# EasyEDA Pro project ProPrj_103-HQU15集成板_Vel2.0.epro, board PCB1
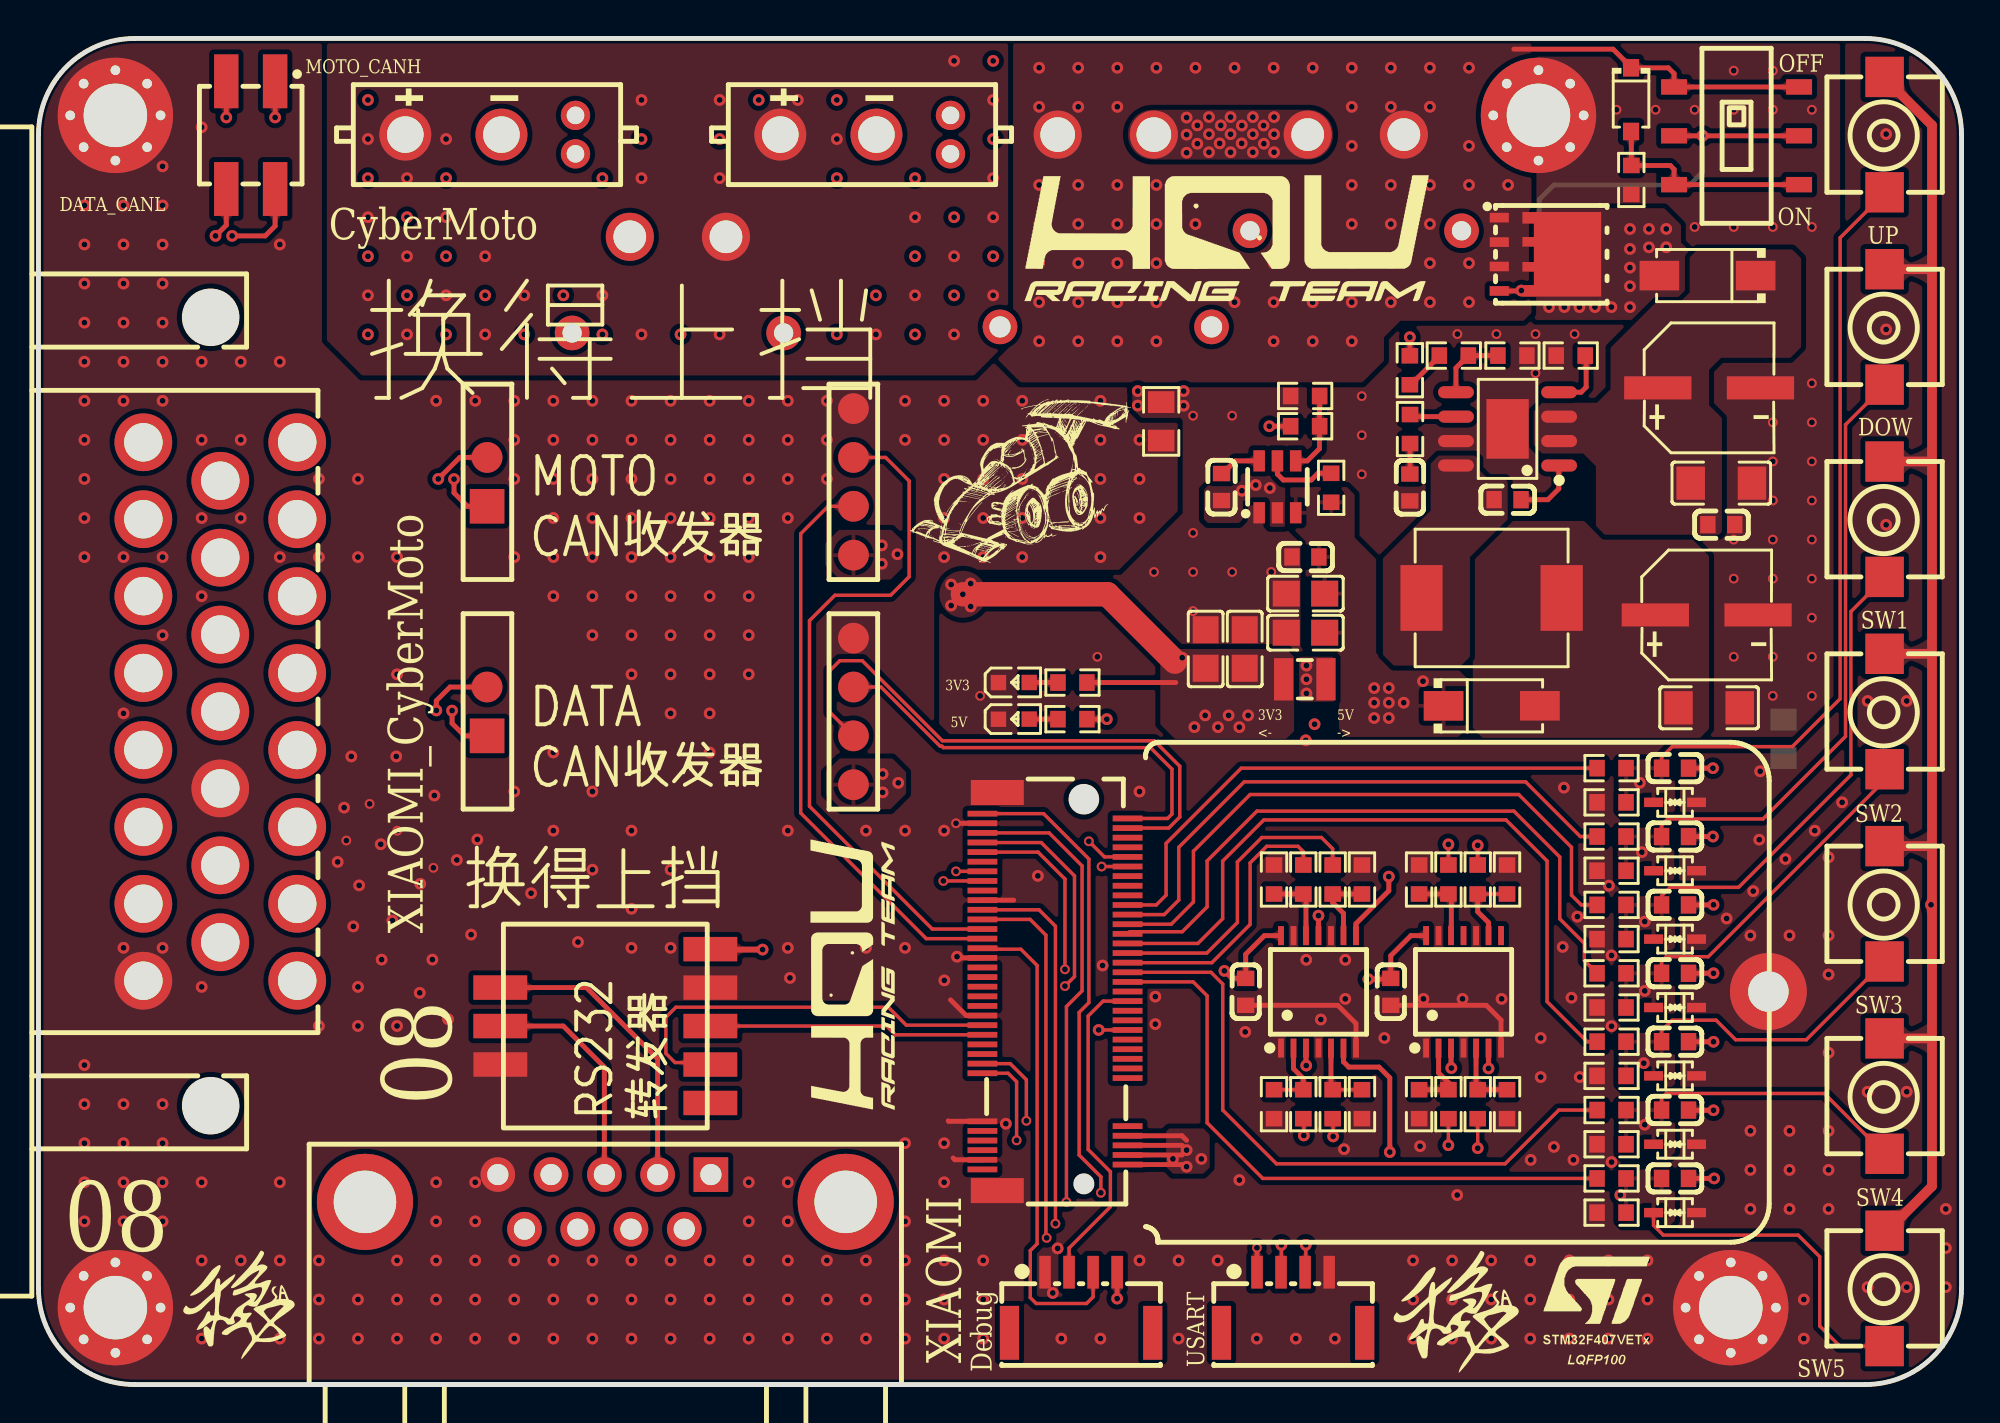
[diagram p6: board, top side]
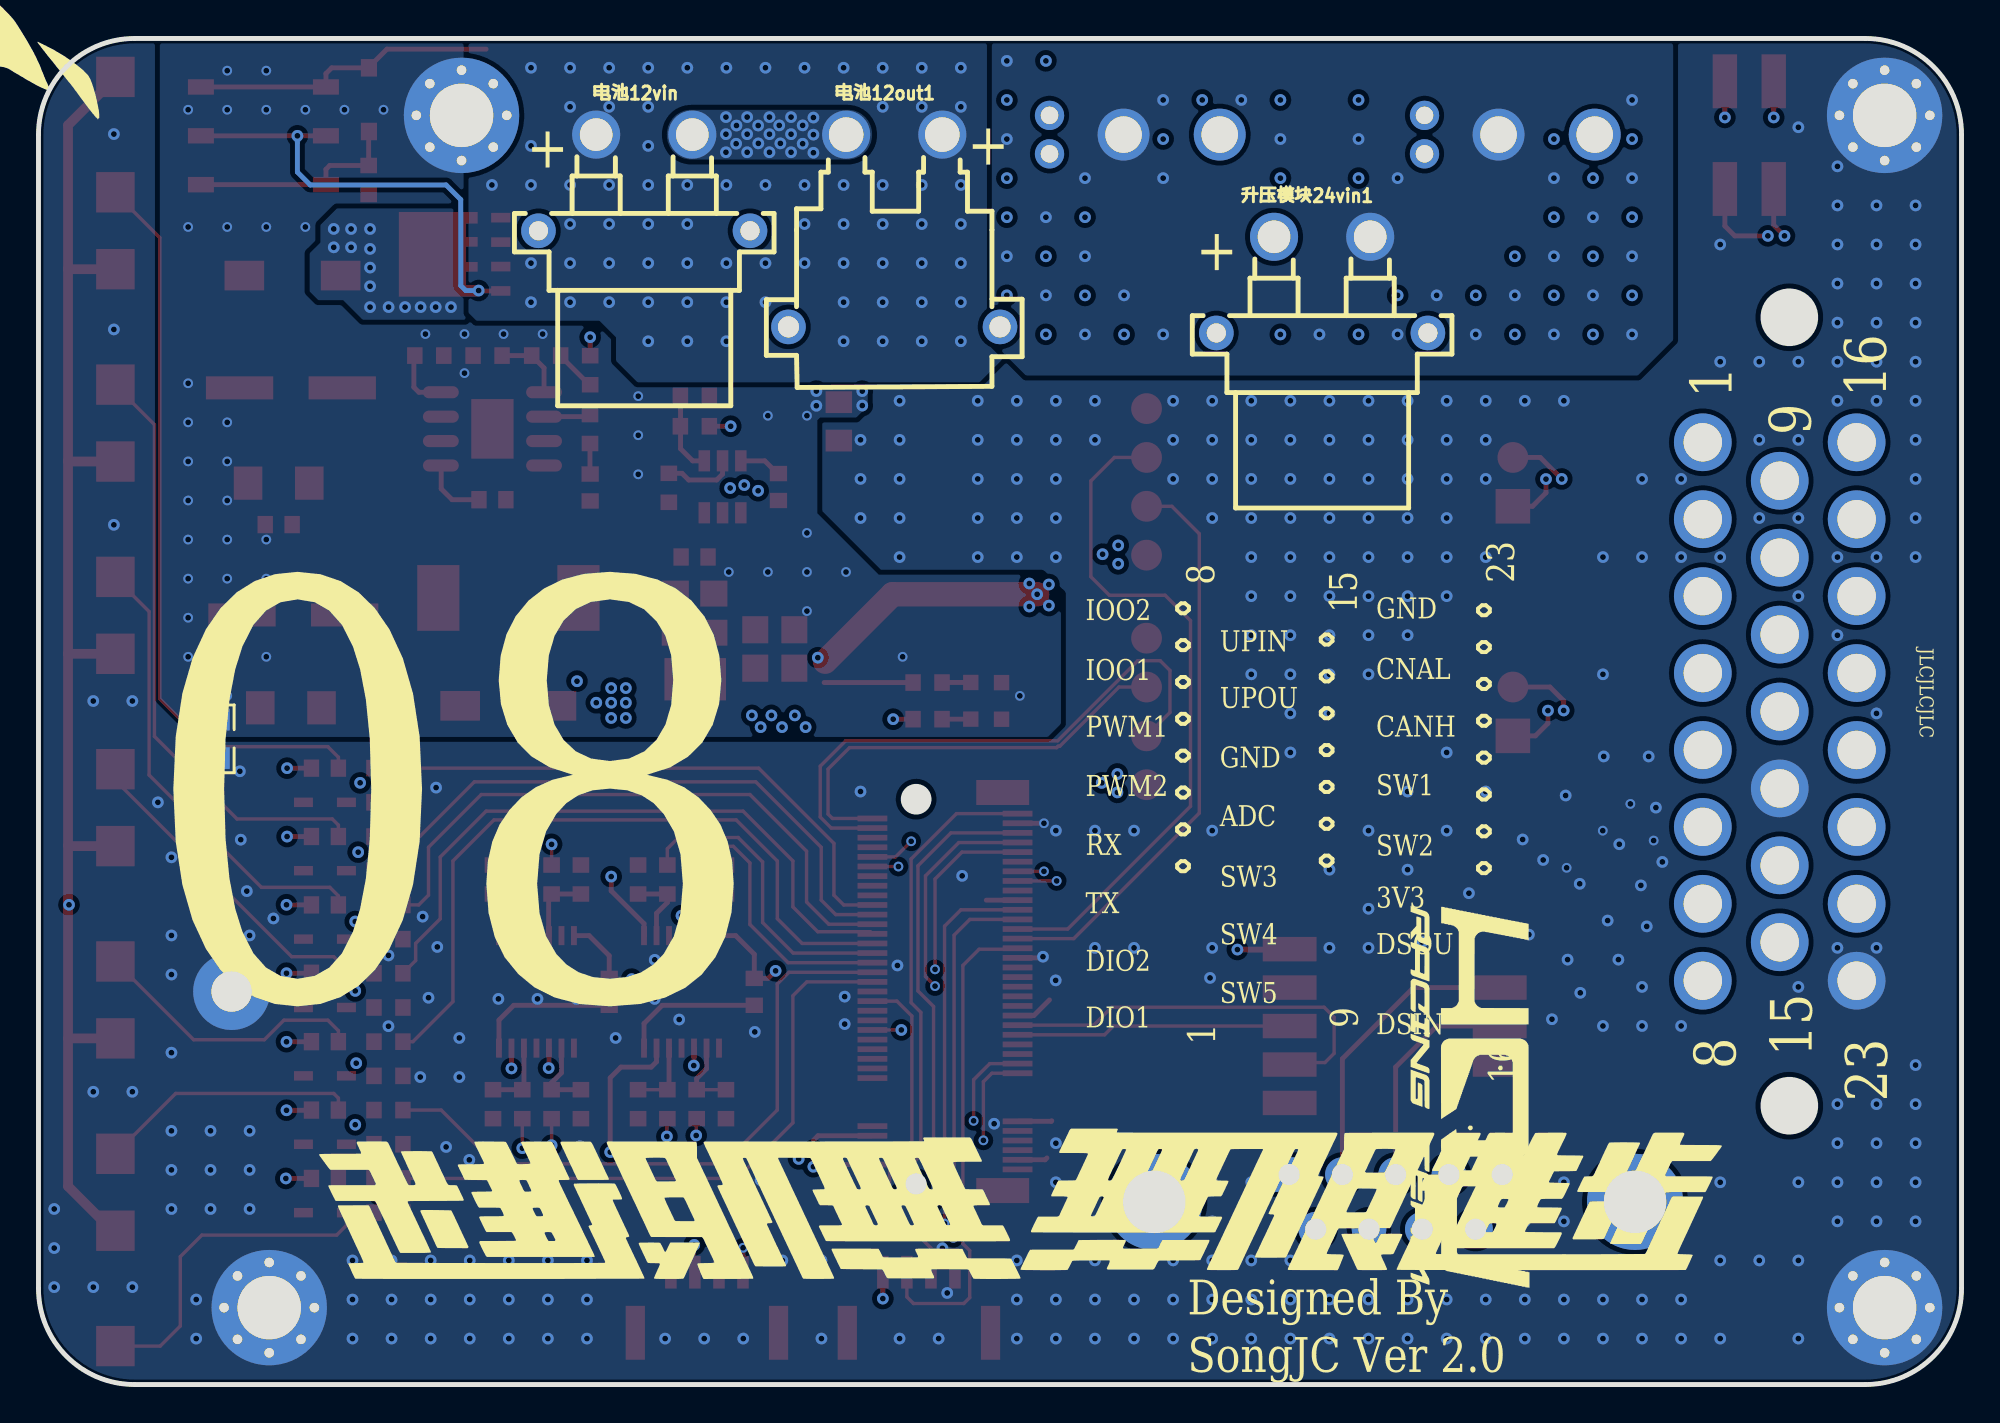
[diagram p7: board, bottom side, seen from below]

Outline 100 x 70 mm; copper layers: Top Layer, Inner1, Inner2, Bottom Layer. Coordinates in mm from the lower left corner of the outline.
Outline path: 0,65 0,5 arc(1.46,1.46) 5,0 95,0 arc(98.54,1.46) 100,5 100,65 arc(98.54,68.54) 95,70 5,70 arc(1.46,68.54) 0,65
Stack: Top Layer 0.035mm 外层铜厚1oz / Dielectric1 0.2104mm 7628 RC49% 8.6mil / Inner1 0.0152mm 内层铜厚 / Dielectric2 1.065mm 1.1mm H/HOZ Copper / Inner2 0.0152mm 内层铜厚 / Dielectric3 0.2104mm 7628 RC49% 8.6mil / Bottom Layer 0.035mm 外层铜厚1oz

## Design rules (mm)
net DATA_CANH: DP2
net DATA_CANL: DP2
net MOTO_CANL: DP1
net MOTO_CANH: DP1
template: 自定义配置
spacing copperThickness1oz (default): track to track 0.102, other pairs 0.152 to 0.3
spacing copperThickness2oz: track to track 0.203, other pairs 0.152 to 0.3
track width copperThickness1oz (default): min 0.127, default 0.254, max 2.54
track width copperThickness2oz: min 0.203, default 0.254, max 2.54
differential pair differentialPair (default): width min 0.127, default 0.254, max 2.54; gap min 0.152, default 0.152
via viaSize (default): diameter min 0.5, default 0.61, max 10; hole min 0.3, default 0.305, max 6.299
net $2N1574 uses ZHILIAN
net $2N643 uses ZHILIAN
net $2N637 uses ZHILIAN
net $2N640 uses ZHILIAN
net GND_PRO uses ZHILIAN
net GND_BAT uses ZHILIAN
net VCC_+3V3 uses ZHILIAN
net VCC_BAT uses ZHILIAN
net VCC_+12V uses ZHILIAN
net VCC_+24V uses ZHILIAN

## Placement (name value [footprint] x y rotation side)
C78  100uF  [CAP-SMD_BD6.3-L6.6-W6.6-LS7.4-FD]  86.87 51.83 0 top
C79  100nF  [C0603]  87.51 44.72 180 top
C80  4.7uF  [c1206]  87.51 46.88 180 top
C81  100nF  [C0603]  76.39 46.02 180 top
C82  47uF  [c1206]  86.87 35.19 180 top
C83  4.7nF  [C0603]  71.31 46.65 270 top
C84  100uF  [CAP-SMD_BD6.3-L6.6-W6.6-LS7.4-FD]  86.75 40.02 0 top
C87  100nF  [C0603]  61.52 46.67 90 top
C88  22uF  [C0805]  60.69 38.25 270 top
C89  22uF  [C0805]  62.73 38.25 270 top
C90  10uF  [C0805]  65.88 39.1 180 top
C91  10uF  [C0805]  65.88 41.13 180 top
C92  100nF  [C0603]  65.88 43.03 180 top
C158  100nF  [C0603]  85.1 28.5 0 top
C160  100nF  [C0603]  85.1 32.05 0 top
C161  100nF  [C0603]  85.1 24.94 0 top
C162  100nF  [C0603]  85.1 21.39 0 top
C163  100nF  [C0603]  85.1 17.83 0 top
C164  100nF  [C0603]  85.1 14.27 0 top
C165  100nF  [C0603]  85.1 10.72 0 top
C166  100nF  [C0603]  70.32 20.42 270 top
C167  100nF  [C0603]  62.78 20.42 270 top
CN2  APCI0078-P002A  [NGFF-SMD-BKEY 5+6(2235))]  53 20.4 90 top
CN5  776087-1  [CONN-TH_776087-1]  9.45 35 270 top
CN16  XT30(2+2)PB-M.G.B  [CONN-TH_XT30PB-M]  43 65 0 top
CN17  XT30(2+2)PB-M.G.B  [CONN-TH_XT30PB-M]  23.5 65 0 top
D2  BZT52C16  [SOD-123_L2.7-W1.7-LS3.8-RD]  82.81 66.82 270 top
D24  SS54  [SMA_L4.4-W2.8-LS5.4-R-RD]  86.79 57.67 180 top
D25  SS54  [SMA_L4.4-W2.8-LS5.4-R-RD]  75.57 35.3 0 top
D32  PESD3V3L1BA-N  [SOD-323_L1.8-W1.3-LS2.5-BI]  85.1 30.28 180 top
D33  PESD3V3L1BA-N  [SOD-323_L1.8-W1.3-LS2.5-BI]  85.1 26.72 180 top
D34  PESD3V3L1BA-N  [SOD-323_L1.8-W1.3-LS2.5-BI]  85.1 23.16 180 top
D35  PESD3V3L1BA-N  [SOD-323_L1.8-W1.3-LS2.5-BI]  85.1 19.61 180 top
D36  PESD3V3L1BA-N  [SOD-323_L1.8-W1.3-LS2.5-BI]  85.1 16.05 180 top
D37  PESD3V3L1BA-N  [SOD-323_L1.8-W1.3-LS2.5-BI]  85.1 12.5 180 top
D38  PESD3V3L1BA-N  [SOD-323_L1.8-W1.3-LS2.5-BI]  85.1 8.94 180 top
H1  X6521WVS-2x02H-C60D74  [hdr-smd_4p-p2.54-v-m-r2-c5-s7.4]  11.04 64.97 180 top
H2  X6521WVS-2x04H-C60D74  [HDR-SMD_8P-P2.54-V-M-R2-C5-S7.4]  29.48 18.64 180 top
H4  PM254V-11-06-H85  [HDR-TH_6P-P2.54-V-F]  42.38 35 90 top
H5  PM254V-11-06-H85  [HDR-TH_6P-P2.54-V-F]  42.38 46.94 90 top
J1  -  [M3螺帽]  88 4 0 top
J2  -  [M3螺帽]  78 66 0 top
J3  -  [M3螺帽]  4 4 0 top
J4  -  [M3螺帽]  4 66 0 top
L4  4.7uH  [IND-SMD_L7.8-W7.0_MAPM0630F]  75.56 40.91 180 top
L5  2.2uH  [IND-SMD_L2.5-W2.0_MHCHL2520]  65.85 36.68 0 top
LED6  NCD0603R1  [LED0603-RD_RED]  50.72 34.6 0 top
LED7  NCD0603R1  [LED0603-RD_RED]  50.72 36.51 0 top
LINK1  WAFER-GH1.25-4PWB  [CONN-SMD_4P-P1.25_XUNPU_WAFER-GH1.25-4PWB]  54.22 4.27 0 top
Q11  TPH1R403NL  [POWERVDFN-8_L6.2-W5.2-P1.27-LS6.0-BL]  77.74 58.77 270 top
R126  200K  [R0603]  79.68 53.51 0 top
R127  51K  [R0603]  71.31 52.75 90 top
R128  1.5K  [R0603]  73.6 53.51 180 top
R129  10K  [R0603]  76.65 53.51 180 top
R130  4.7K  [R0603]  53.77 34.6 0 top
R131  20K  [R0603]  71.32 49.69 270 top
R132  10K  [R0603]  82.83 62.64 90 top
R135  4.7K  [R0603]  53.77 36.51 0 top
R136  10kΩ  [R0603]  67.22 46.63 90 top
R137  10kΩ  [R0603]  65.87 51.41 0 top
R138  33.2kΩ  [R0603]  65.87 49.83 0 top
R194  1kΩ  [R0603]  81.8 32.05 0 top
R195  4.7kΩ  [R0603]  81.8 30.28 0 top
R196  0Ω  [R0805]  58.38 50.09 270 top
R198  4.7kΩ  [R0603]  81.8 26.72 0 top
R199  1kΩ  [R0603]  81.8 24.94 0 top
R200  4.7kΩ  [R0603]  81.8 23.16 0 top
R211  1kΩ  [R0603]  81.8 21.39 0 top
R212  4.7kΩ  [R0603]  81.8 19.61 0 top
R213  0Ω  [R0805]  90.74 33.58 270 bottom
R216  1kΩ  [R0603]  81.8 17.83 0 top
R217  4.7kΩ  [R0603]  81.8 16.05 0 top
R218  1kΩ  [R0603]  81.8 14.27 0 top
R219  4.7kΩ  [R0603]  81.8 12.5 0 top
R220  1kΩ  [R0603]  81.8 10.72 0 top
R221  4.7kΩ  [R0603]  81.8 8.94 0 top
R222  10kΩ  [R0603]  76.37 14.58 90 top
R223  10kΩ  [R0603]  71.79 14.58 90 top
R224  10kΩ  [R0603]  76.37 26.26 270 top
R225  10kΩ  [R0603]  71.79 26.26 270 top
R226  100R  [R0603]  73.32 26.26 90 top
R227  100R  [R0603]  74.84 26.26 90 top
R228  100R  [R0603]  73.32 14.58 270 top
R229  100R  [R0603]  74.84 14.58 270 top
R230  10kΩ  [R0603]  68.82 14.58 90 top
R231  10kΩ  [R0603]  64.25 14.58 90 top
R232  10kΩ  [R0603]  68.82 26.26 270 top
R233  10kΩ  [R0603]  64.25 26.26 270 top
R234  100R  [R0603]  65.77 26.26 90 top
R235  100R  [R0603]  67.3 26.26 90 top
R236  100R  [R0603]  65.77 14.58 270 top
R237  100R  [R0603]  67.3 14.58 270 top
R238  1kΩ  [R0603]  81.8 28.5 0 top
SW1  SS-3235S-L3  [SW-SMD_SS-3235S-L3.00]  88.3 64.94 90 top
SW9  K2-1817UQ-C4SW-01  [KEY-SMD_2P-L6.0-W6.0-P6.00]  96 55 90 top
SW11  K2-1817UQ-C4SW-01  [KEY-SMD_2P-L6.0-W6.0-P6.00]  96 65 90 top
SW12  K2-1817UQ-C4SW-01  [KEY-SMD_2P-L6.0-W6.0-P6.00]  96 45 90 top
SW13  K2-1817UQ-C4SW-01  [KEY-SMD_2P-L6.0-W6.0-P6.00]  96 35 90 top
SW14  K2-1817UQ-C4SW-01  [KEY-SMD_2P-L6.0-W6.0-P6.00]  96 25 90 top
SW15  K2-1817UQ-C4SW-01  [KEY-SMD_2P-L6.0-W6.0-P6.00]  96 15 90 top
SW16  K2-1817UQ-C4SW-01  [KEY-SMD_2P-L6.0-W6.0-P6.00]  96 5 90 top
U27  SP1N28STER  [ESOP-8_L4.9-W3.9-P1.27-LS6.0-BL-EP3.1]  76.39 49.7 90 top
U32  TPS563201DDCR  [SOT-23-6_L2.9-W1.6-P0.95-LS2.8-BR]  64.43 46.68 270 top
U54  DR-9F  [DR9-TH_ZHOUR_DR-9P-L]  29.48 9.5 0 top
U55  SN74HC125PWR  [TSSOP-14_L5.0-W4.4-P0.65-LS6.5-BL]  74.1 20.42 0 top
U56  SN74HC125PWR  [TSSOP-14_L5.0-W4.4-P0.65-LS6.5-BL]  66.56 20.42 0 top
USART1  WAFER-GH1.25-4PWB  [CONN-SMD_4P-P1.25_XUNPU_WAFER-GH1.25-4PWB]  65.24 4.27 0 top
升压模块24vin1  XT30PW-F20.G.Y  [CONN-TH_XT30PW-F-1]  33.25 57.19 180 bottom
电池12out1  XT30PW-M30.G.Y  [CONN-TH_XT30PW-M]  55.5 60 180 bottom
电池12vin  XT30PW-F20.G.Y  [CONN-TH_XT30PW-F-1]  68.5 62.5 180 bottom

## Footprints (pads in the part's own frame, mm; a bottom-side part is the same pattern mirrored in y, then rotated)
C0603
  rect 0.8x0.9 smd: 1(-0.7,0) 2(0.7,0)
C0805
  rect 1.41x1.35 smd: 1(-1,0) 2(1,0)
c1206
  rect 1.485x1.728 smd: 1(-1.593,0) 2(1.593,0)
CAP-SMD_BD6.3-L6.6-W6.6-LS7.4-FD
  rect 3.5x1.2 smd: 1(-2.67,0) 2(2.67,0)
CONN-SMD_4P-P1.25_XUNPU_WAFER-GH1.25-4PWB
  rect 0.6x1.7 smd: 1(-1.875,1.575) 2(-0.625,1.575) 3(0.625,1.575) 4(1.875,1.575)
  rect 1x2.8 smd: 5(3.725,-1.575) 6(-3.725,-1.575)
CONN-TH_776087-1
  round 3 hole 2: 1(-14,4) 2(-10,4) 3(-6,4) 4(-2,4) 5(2,4) 6(6,4) 7(10,4) 8(14,4) 9(-12,0) 10(-8,0) 11(-4,0) 12(0,0) 13(4,0) 14(8,0) 15(12,0) 16(-14,-4) 17(-10,-4) 18(-6,-4) 19(-2,-4) 20(2,-4) 21(6,-4) 22(10,-4) 23(14,-4)
CONN-TH_XT30PB-M
  round 1.524 hole 0.914: 1(4.425,1) 2(4.425,-1)
  round 2.7 hole 1.9: 3(0.575,0) 4(-4.425,0)
CONN-TH_XT30PW-F-1
  round 2.5 hole 1.7: 1(-2.5,2.5) 2(2.5,2.5)
  round 1.8 hole 1: 3(5.5,-2.5) 4(-5.5,-2.5)
CONN-TH_XT30PW-M
  round 2.5 hole 1.8: 1(-2.5,5) 2(2.5,5)
  round 1.8 hole 1.1: 3(5.5,-5) 4(-5.5,-5)
DR9-TH_ZHOUR_DR-9P-L
  rect 1.8x1.8 hole 1.1: 1(5.489,1.42)
  round 1.8 hole 1.1: 2(2.719,1.42) 3(-0.051,1.42) 4(-2.821,1.42) 5(-5.59,1.42) 6(4.104,-1.42) 7(1.335,-1.42) 8(-1.435,-1.42) 9(-4.205,-1.42)
  round 5 hole 3.25: 10(-12.5,0) 11(12.5,0)
ESOP-8_L4.9-W3.9-P1.27-LS6.0-BL-EP3.1
  oval 0.63x1.865 smd: 1(-1.905,-2.683) 2(-0.635,-2.683) 3(0.635,-2.683) 4(1.905,-2.683) 5(1.905,2.683) 6(0.635,2.683) 7(-0.635,2.683) 8(-1.905,2.683)
  rect 3.1x2.2 smd: 9(0,0)
hdr-smd_4p-p2.54-v-m-r2-c5-s7.4
  rect 1.27x2.8 smd: 1(-1.27,-2.8) 2(-1.27,2.8) 3(1.27,-2.8) 4(1.27,2.8)
HDR-SMD_8P-P2.54-V-M-R2-C5-S7.4
  rect 2.8x1.27 smd: 1(5.461,-2) 2(5.461,0) 3(5.461,2) 4(-5.461,4) 5(-5.461,2) 6(-5.461,0) 7(-5.461,-2) 8(-5.461,-4)
HDR-TH_6P-P2.54-V-F
  rect 1.8x1.8 smd: 1(-1.267,19.05)
  round 1.6 smd: 2(1.273,19.05) 3(-3.807,0) 4(-1.267,0) 5(1.273,0) 6(3.813,0)
IND-SMD_L2.5-W2.0_MHCHL2520
  rect 1x2.2 smd: 1(-1.1,0) 2(1.1,0)
IND-SMD_L7.8-W7.0_MAPM0630F
  rect 2.194x3.42 smd: 1(3.643,0) 2(-3.643,0)
KEY-SMD_2P-L6.0-W6.0-P6.00
  rect 2.1x2 smd: 1(-3,0) 2(3,0)
LED0603-RD_RED
  rect 0.8x0.8 smd: 1(-0.799,-0.004) 2(0.799,0.004)
M3螺帽
  round 6 hole 3.302: 1(0,0)
  round 1 hole 0.5: 2(0,2.349) 3(0,-2.349) 4(2.349,0) 5(-2.349,0) 6(1.651,1.651) 7(-1.651,-1.651) 8(1.651,-1.651) 9(-1.651,1.651)
NGFF-SMD-BKEY 5+6(2235))
  rect 0.3x1.55 smd: 1(-9.212,3.914) 2(-8.962,-3.635) 3(-8.712,3.914) 4(-8.462,-3.635) 5(-8.212,3.914) 6(-7.962,-3.635) 7(-7.712,3.914) 8(-7.462,-3.635) 9(-7.212,3.914) 10(-6.962,-3.635) 11(-6.712,3.914) 20(-4.462,-3.635) 21(-4.212,3.914) 22(-3.962,-3.635) 23(-3.712,3.914) 24(-3.462,-3.635) 25(-3.212,3.914) 26(-2.962,-3.635) 27(-2.712,3.914) 28(-2.462,-3.635) 29(-2.212,3.914) 30(-1.962,-3.635) 31(-1.712,3.914) 32(-1.462,-3.635) 33(-1.212,3.914) 34(-0.962,-3.635) 35(-0.712,3.914) 36(-0.462,-3.635) 37(-0.212,3.914) 38(0.038,-3.635) 39(0.288,3.914) 40(0.538,-3.635) 41(0.788,3.914) 42(1.038,-3.635) 43(1.288,3.914) 44(1.538,-3.635) 45(1.788,3.914) 46(2.038,-3.635) 47(2.288,3.914) 48(2.538,-3.635) 49(2.788,3.914) 50(3.038,-3.635) 51(3.288,3.914) 52(3.538,-3.635) 53(3.788,3.914) 54(4.038,-3.635) 55(4.288,3.914) 56(4.538,-3.635) 57(4.788,3.914) 58(5.038,-3.635) 59(5.288,3.914) 60(5.538,-3.635) 61(5.788,3.914) 62(6.038,-3.635) 63(6.288,3.914) 64(6.538,-3.635) 65(6.788,3.914) 66(7.038,-3.635) 67(7.288,3.914) 68(7.538,-3.635) 69(7.788,3.914) 70(8.038,-3.635) 71(8.288,3.914) 72(8.538,-3.635) 73(8.788,3.914) 74(9.038,-3.635) 75(9.288,3.914)
  round 4 hole 2.1: 12(0.038,-36.957)
  rect 1.3x2.75 smd: 76(-10.312,3.139) 77(10.388,3.139)
POWERVDFN-8_L6.2-W5.2-P1.27-LS6.0-BL
  rect 0.5x1 smd: 1(-1.905,-1.775) 2(-0.635,-1.775) 3(0.635,-1.775) 4(1.905,-1.775)
  custom 4.4x4.1 smd: 5(0,1.775)
R0603
  rect 0.806x0.864 smd: 1(-0.753,0) 2(0.753,0)
R0805
  rect 1.133x1.377 smd: 1(-1,0) 2(1,0)
SMA_L4.4-W2.8-LS5.4-R-RD
  rect 2.062x1.539 smd: 1(2.503,0) 2(-2.503,0)
SOD-123_L2.7-W1.7-LS3.8-RD
  rect 0.91x0.84 smd: 1(-1.655,0) 2(1.655,0)
SOD-323_L1.8-W1.3-LS2.5-BI
  rect 0.985x0.49 smd: 1(-1.117,0) 2(1.117,0)
SOT-23-6_L2.9-W1.6-P0.95-LS2.8-BR
  rect 1.1x0.6 smd: 1(1.35,-0.95) 2(1.35,0) 3(1.35,0.95) 4(-1.35,0.95) 5(-1.35,0) 6(-1.35,-0.95)
SW-SMD_SS-3235S-L3.00
  rect 0.8x1.35 smd: 1(-2.54,3.25) 2(0,3.25) 3(2.54,3.25) 4(-2.54,-3.25) 5(0,-3.25) 6(2.54,-3.25)
TSSOP-14_L5.0-W4.4-P0.65-LS6.5-BL
  rect 0.305x0.991 smd: 1(-1.95,-2.925) 2(-1.3,-2.925) 3(-0.65,-2.925) 4(0,-2.925) 5(0.65,-2.925) 6(1.3,-2.925) 7(1.95,-2.925) 8(1.95,2.925) 9(1.3,2.925) 10(0.65,2.925) 11(0,2.925) 12(-0.65,2.925) 13(-1.3,2.925) 14(-1.95,2.925)

## Nets
As in the schematic, except:
GND_BAT: C78.2 C79.1 C80.1 C82.1 C83.2 C84.2 C88.1 C89.1 C90.2 C91.2 C92.2 CN16.3 CN17.3 J2.1 J2.2 J2.3 J2.4 J2.5 J2.6 J2.7 J2.8 J2.9 LED6.1 LED7.1 R126.1 R129.1 R132.1 R137.1 R196.1 R213.1 U27.7 U27.9 U32.1 升压模块24vin1.2 电池12out1.1 电池12vin.2
GND_PRO: C166.2 C167.2 CN2.3 CN2.11 CN2.12 CN2.33 CN2.45 CN2.57 CN2.73 CN2.76 CN2.77 CN5.13 CN5.23 D32.1 D33.1 D34.1 D35.1 D36.1 D37.1 D38.1 H2.3 H2.7 H4.6 H5.6 J1.1 J1.2 J1.3 J1.4 J1.5 J1.6 J1.7 J1.8 J1.9 J3.1 J3.2 J3.3 J3.4 J3.5 J3.6 J3.7 J3.8 J3.9 J4.1 J4.2 J4.3 J4.4 J4.5 J4.6 J4.7 J4.8 J4.9 LINK1.1 R195.1 R196.2 R198.1 R200.1 R212.1 R213.2 R217.1 R219.1 R221.1 R222.1 R223.1 R224.1 R225.1 R230.1 R231.1 R232.1 R233.1 U54.5 U55.1 U55.4 U55.7 U55.10 U55.13 U56.1 U56.4 U56.7 U56.10 U56.13 USART1.4

Pads without a net: H2 4; LINK1 5 6; U54 1 4 6 7 8 9 10 11; USART1 5 6; 升压模块24vin1 3 4; 电池12out1 3 4; 电池12vin 3 4

## Via types
v1: diameter 0.61, hole 0.305, Top Layer to Bottom Layer, 621 vias
v2: diameter 0.508, hole 0.305, Top Layer to Bottom Layer, 67 vias

## Routing (per net, layer and track width the routed paths; a pad name or vN(x,y) marks a point on that pad's centre or on a via; arc(x,y) is an arc through that point)
GND_BAT:
  vias: v1(17.13,66.8) v1(17.13,62.74) v1(17.13,58.67) v1(17.13,54.61) v1(19.16,60.7) v1(19.16,56.64) v1(21.2,62.74) v1(21.2,58.67) v1(21.2,54.61) v1(23.23,56.64) v1(25.26,54.61) v1(27.29,56.64) v1(29.32,62.74) v1(29.32,54.61) v1(31.36,64.77) v1(33.39,54.61) v1(35.42,64.77) v1(37.45,66.8) v1(41.52,66.8) v1(41.52,62.74) v1(41.52,54.61) v1(43.55,56.64) v1(45.58,62.74) v1(45.58,58.67) v1(45.58,54.61) v1(47.61,60.7) v1(47.61,56.64) v1(49.64,68.83) v1(49.64,64.77) v1(49.64,58.67) v1(57.16,51.66) v1(57.16,50.91) v1(59.55,51.66) v1(59.55,50.9) v1(59.7,65.89) v1(59.7,65) v1(59.7,64.06) v1(60.26,65.48) v1(60.26,64.53) v1(60.87,65.91) v1(60.87,65.02) v1(60.87,64.08) v1(61.42,64.54) v1(61.48,65.48) v1(61.99,65.91) v1(61.99,65.02) v1(61.99,64.08) v1(62.58,65.47) v1(62.57,64.54) v1(63.15,65.91) v1(63.15,65.02) v1(63.15,64.08) v1(63.7,65.47) v1(63.72,64.53) v1(64.25,65.91) v1(64.25,65.02) v1(64.25,64.08) v1(66.36,34.34) v2(48.97,35.81) v2(55.06,37.84) v2(58.01,42.25) v2(60.04,50.38) v2(60.04,44.29) v2(60.04,42.25) v2(60.04,40.22) v2(62.07,50.38) v2(62.07,42.25) v2(64.1,42.25) v2(68.81,51.4) v2(68.81,49.37) v2(68.81,47.33) v2(73.78,54.63) v2(75.81,54.63) v2(77.85,54.63) v2(77.85,52.6) v2(79.88,54.63) v2(82.06,66.29) v2(84.09,66.29) v2(86.12,66.29) v2(86.12,60.2) v2(88.15,68.33) v2(88.15,66.29) v2(88.15,60.2) v2(88.15,43.94) v2(88.15,41.91) v2(88.15,37.84) v2(90.19,68.33) v2(90.19,66.29) v2(90.19,60.2) v2(90.19,50.04) v2(90.19,48) v2(90.19,45.97) v2(90.19,43.94) v2(90.19,41.91) v2(90.19,37.84) v2(90.19,35.81) v2(92.22,66.29) v2(92.22,60.2) v2(92.22,52.07) v2(92.22,50.04) v2(92.22,48) v2(92.22,45.97) v2(92.22,43.94) v2(92.22,41.91) v2(92.22,39.88) v2(92.22,37.84) v2(92.22,35.81)
GND_PRO: length 24.4
  Top Layer w0.254: CN2.45 47.93,22.19 47.92,22.2 ; U56.7 68.51,18.78 67.57,19.72 C167.2 ; 47.43,20 48.24,19.19 CN2.33 ; CN2.11 47.33,13.69 47.31,13.72 ; v2(47.71,29.19) CN2.73 ; 47.56,11.78 47.66,11.69 CN2.3 ; CN2.57 50.71,25.19 ; U55.7 76.05,18.95 75.29,19.72 C166.2
  vias: v1(2.39,61.32) v1(2.39,59.29) v1(2.39,57.25) v1(2.39,55.22) v1(2.39,53.19) v1(2.39,51.16) v1(2.39,49.13) v1(2.39,47.09) v1(2.39,45.06) v1(2.39,43.03) v1(2.39,16.61) v1(2.39,14.58) v1(2.39,12.55) v1(2.39,10.52) v1(2.39,8.49) v1(4.42,61.32) v1(4.42,59.29) v1(4.42,57.25) v1(4.42,55.22) v1(4.42,53.19) v1(4.42,51.16) v1(4.42,43.03) v1(4.42,34.9) v1(4.42,22.71) v1(4.42,14.58) v1(4.42,12.55) v1(4.42,10.52) v1(4.42,8.49) v1(6.45,63.35) v1(6.45,61.32) v1(6.45,59.29) v1(6.45,57.25) v1(6.45,55.22) v1(6.45,53.19) v1(6.45,51.16) v1(6.45,43.03) v1(6.45,38.97) v1(6.45,22.71) v1(6.45,14.58) v1(6.45,12.55) v1(6.45,10.52) v1(6.45,8.49) v1(8.49,65.38) v1(8.49,53.19) v1(8.49,49.13) v1(8.49,45.06) v1(8.49,41) v1(8.49,20.68) v1(8.49,10.52) v1(8.49,6.45) v1(8.49,2.39) v1(10.52,53.19) v1(10.52,49.13) v1(10.52,45.06) v1(10.52,6.45) v1(12.55,59.29) v1(12.55,53.19) v1(12.55,43.03) v1(12.55,10.52) v1(12.55,6.45) v1(12.55,2.39) v1(14.58,47.09) v1(14.58,43.03) v1(14.58,18.65) v1(14.58,6.45) v1(14.58,4.42) v1(14.58,2.39) v1(15.56,27.18) v1(15.89,30) v1(16.27,32.66) v1(16.37,23.82) v1(16.61,47.09) v1(16.61,43.03) v1(16.61,20.68) v1(16.61,18.65) v1(16.61,4.42) v1(16.61,2.39) v1(16.67,25.96) v1(17.8,28.1) v1(17.84,22.1) v1(18.4,24.13) v1(18.65,43.03) v1(18.65,36.93) v1(18.61,32.66) v1(18.65,18.65) v1(18.65,6.45) v1(18.65,4.42) v1(18.65,2.39) v1(19.83,20.37) v1(19.86,26.04) v1(20.48,22.1) v1(20.59,30.63) v1(20.68,51.16) v1(20.68,10.52) v1(20.68,8.49) v1(20.68,6.45) v1(20.68,4.42) v1(20.68,2.39) v1(21.3,19) v1(21.75,27.28) v1(22.5,23.4) v1(22.71,51.16) v1(22.71,10.52) v1(22.71,8.49) v1(22.71,6.45) v1(22.71,4.42) v1(22.71,2.39) v1(22.82,28.34) v1(24.74,51.16) v1(24.74,49.13) v1(24.74,47.09) v1(24.74,43.03) v1(24.74,30.84) v1(24.74,6.45) v1(24.74,4.42) v1(24.74,2.39) v1(25.62,25.55) v1(26.77,51.16) v1(26.77,49.13) v1(26.77,47.09) v1(26.77,45.06) v1(26.77,43.03) v1(26.77,41) v1(26.77,32.87) v1(26.77,28.81) v1(26.77,6.45) v1(26.77,4.42) v1(26.77,2.39) v1(28.05,23.01) v1(28.81,51.16) v1(28.81,49.13) v1(28.81,47.09) v1(28.81,45.06) v1(28.81,43.03) v1(28.81,41) v1(28.81,38.97) v1(28.81,30.84) v1(28.81,26.77) v1(28.81,6.45) v1(28.81,4.42) v1(28.81,2.39) v1(30.84,51.16) v1(30.84,49.13) v1(30.84,47.09) v1(30.84,45.06) v1(30.84,43.03) v1(30.84,41) v1(30.84,38.97) v1(30.84,36.93) v1(30.84,28.81) v1(30.84,24.74) v1(30.84,22.71) v1(30.84,6.45) v1(30.84,4.42) v1(30.84,2.39) v1(32.87,51.16) v1(32.87,49.13) v1(32.87,47.09) v1(32.87,45.06) v1(32.87,43.03) v1(32.87,41) v1(32.87,38.97) v1(32.87,36.93) v1(32.87,34.9) v1(32.87,26.77) v1(32.87,22.71) v1(32.87,6.45) v1(32.87,4.42) v1(32.87,2.39) v1(34.9,51.16) v1(34.9,49.13) v1(34.9,47.09) v1(34.9,45.06) v1(34.9,43.03) v1(34.9,41) v1(34.9,38.97) v1(34.9,36.93) v1(34.9,34.9) v1(34.9,32.87) v1(34.9,6.45) v1(34.9,4.42) v1(34.9,2.39) v1(36.93,51.16) v1(36.93,49.13) v1(36.93,47.09) v1(36.93,45.06) v1(36.93,43.03) v1(36.93,41) v1(36.93,38.97) v1(36.93,36.93) v1(36.93,10.52) v1(36.93,8.49) v1(36.93,6.45) v1(36.93,4.42) v1(36.93,2.39) v1(38.97,51.16) v1(38.97,49.13) v1(38.97,47.09) v1(38.97,45.06) v1(38.97,28.81) v1(38.97,22.71) v1(38.97,10.52) v1(38.97,8.49) v1(38.97,6.45) v1(38.97,4.42) v1(38.97,2.39) v1(39.08,21.14) v1(41,51.16) v1(41,49.13) v1(41,47.09) v1(41,6.45) v1(41,4.42) v1(41,2.39) v1(43.03,28.81) v1(43.03,22.71) v1(43.03,6.45) v1(43.03,4.42) v1(43.03,2.39) v1(45.06,51.16) v1(45.06,49.13) v1(45.06,28.81) v1(45.06,22.71) v1(45.06,12.55) v1(45.06,8.49) v1(45.06,6.45) v1(45.06,4.42) v1(45.06,2.39) v1(47.09,51.16) v1(47.09,49.13) v1(47.09,47.09) v1(47.09,45.06) v1(47.09,43.03) v1(47.09,28.81) v1(47.1,21.02) v1(47.09,12.55) v1(47.09,10.52) v1(47.09,6.45) v1(47.09,4.42) v1(47.09,2.39) v1(47.76,22.25) v1(49.13,51.16) v1(49.13,49.13) v1(49.13,47.09) v1(49.13,45.06) v1(49.13,43.03) v1(49.13,6.45) v1(49.13,4.42) v1(49.13,2.39) v1(50.31,13.56) v1(51.16,51.16) v1(51.16,49.13) v1(51.16,47.09) v1(51.16,45.06) v1(51.16,43.03) v1(51.97,26.45) v1(52.75,4.76) v1(53,7.08) v1(53.19,2.39) v1(55.22,51.16) v1(55.22,49.13) v1(55.22,47.09) v1(55.22,45.06) v1(55.22,43.03) v1(55.22,2.39) v1(55.33,21.79) v1(57.25,49.13) v1(57.25,47.09) v1(57.25,45.06) v1(57.25,30.84) v1(57.25,6.45) v1(58.08,20.17) v1(58.08,18.74) v1(59.29,6.45) v1(59.29,2.39) v1(61.32,6.45) v1(62.45,10.63) v1(62.75,18.34) v1(63.35,2.39) v1(65.38,2.39) v1(65.9,33.5) v1(65.92,22.09) v1(66.68,18.98) v1(67.41,2.39) v1(67.89,12.24) v1(67.96,22.09) v1(67.96,20.05) v1(69.99,18.02) v1(71.48,6.45) v1(71.48,4.42) v1(71.48,2.39) v1(71.84,12.39) v1(72.02,20.05) v1(73.51,6.45) v1(73.51,4.42) v1(73.51,2.39) v1(73.77,9.85) v1(74.05,20.05) v1(75.54,6.45) v1(75.54,4.42) v1(75.54,2.39) v1(76.08,20.05) v1(77.6,11.68) v1(77.57,6.45) v1(77.57,4.42) v1(77.57,2.39) v1(78.12,18.02) v1(78.12,15.99) v1(78.8,12.36) v1(79.32,31.04) v1(79.26,22.76) v1(79.61,6.45) v1(79.61,4.42) v1(79.61,2.39) v1(79.72,20.12) v1(79.82,11.68) v1(80.02,24.33) v1(80.15,15.99) v1(81.64,6.45) v1(81.64,4.42) v1(81.64,2.39) v1(81.66,25.94) v1(81.8,22.32) v1(81.8,18.63) v1(81.8,11.57) v1(83.67,6.45) v1(83.67,4.42) v1(83.67,2.39) v1(87.78,24.24) v1(89.02,23.35) v1(89.02,13.19) v1(89.02,11.16) v1(89.02,9.13) v1(89.17,25.66) v1(89.53,31.89) v1(89.48,28.33) v1(90.84,27.33) v1(91.05,23.35) v1(91.05,13.19) v1(91.05,11.16) v1(91.05,9.13) v1(91.8,4.42) v1(91.8,2.39) v1(92.37,28.8) v1(93.09,27.42) v1(93.09,23.35) v1(93.09,21.32) v1(93.09,17.26) v1(93.09,13.19) v1(93.09,11.16) v1(93.09,9.13) v1(93.79,30.28) v1(95.12,35.55) v1(95.12,15.23) v1(95.12,5.07) v1(96.08,65.03) v1(96.08,54.87) v1(96.08,44.71) v1(97.15,35.55) v1(97.15,15.23) v1(97.15,5.07) v1(99.18,9.13) v1(99.18,7.1) v1(99.18,5.07) v2(16.01,28.29) v2(17.22,30.19) v2(18.66,28.8) v2(20.54,26.87)
VCC_+3V3: length 343.7
  Top Layer w0.254: v1(87.1,14.26) 85.81,14.26 C164.2 ; C160.2 v1(87.07,32.05) ; v1(61.67,21.51) 62.06,21.12 C167.1 62.78,22.38 63.75,23.35 U56.14 ; v1(87.13,10.72) C165.2 ; C163.2 85.81,17.82 v1(87.1,17.82) ; R135.2 59.14,36.51 ; v1(69.15,21.08) 70.28,21.08 C166.1 70.32,22.3 71.37,23.35 U55.14 ; C158.2 v1(87.07,28.5) ; v1(56.09,4.47) LINK1.4 ; v1(87.1,24.95) 87.1,24.94 C161.2 ; C162.2 85.81,21.39 v1(87.1,21.39) ; R138.1 v1(64,49.83)
  Top Layer w0.305: v1(37.66,22.62) 34.96,22.62 H2.8
  Top Layer w0.508: 98.46,58.01 98.46,65.49 96,67.95 SW11.2 ; 98.46,58.01 98.46,58 SW9.2 ; 98.46,58.01 98.46,48.02 ; 98.46,28.02 98.46,10.31 96.15,8 SW16.2 ; 98.46,28.02 98.46,38.01 ; 98.46,28.02 98.44,28 SW14.2 ; 98.46,38.01 98.46,38 SW13.2 ; 98.46,38.01 98.46,48.02 ; SW12.2 98.44,48 98.46,48.02 ; SW15.2 98.46,18
  Top Layer w1.27: v1(48.07,41.1) 55.59,41.1 59.09,37.59
  Inner1 w0.305: v1(69.15,21.08) 62.1,21.08 v1(61.67,21.51)
  Inner1 w0.508: v1(87.07,32.05) v1(87.07,28.5) 87.07,21.39 ; v1(87.1,24.95) v1(98.41,24.95) ; 87.07,21.39 87.07,10.78 v1(87.13,10.72) ; 87.07,21.39 69.46,21.39 v1(69.15,21.08) 69.15,5.49 68.14,4.47 v1(56.09,4.47)
  Inner1 w1.016: v1(69.15,21.08) 69.15,29.06 74.49,34.39 74.49,38.71 72.81,40.39 63.21,40.39 61.89,39.06 v1(61.89,34.8)
  Inner1 w1.27: CN5.18 1.94,37.49 1.94,19.76 4.48,17.22 32.26,17.22 v1(37.66,22.62) 37.66,35.66 43.09,41.1 v1(48.07,41.1)
  Inner2 w0.254: v1(59.47,37.8) 59.47,48.33 60.97,49.83 v1(64,49.83)
  vias: v1(47.46,41.6) v1(47.46,40.51) v1(48.48,41.66) v1(48.48,40.46) v1(60.11,34.19) v1(60.67,34.8) v1(61.34,34.19) v1(62.45,34.19) v1(62.9,34.8)
VCC_+5V: length 87.9
  Top Layer w0.254: USART1.1 63.36,5.85 v2(63.36,7.11) ; v1(71.31,54.46) R127.2 ; v1(59.7,11.33) 59.59,11.44 CN2.2 ; CN2.6 59.46,12.44 v1(59.7,12.19) 59.45,11.94 CN2.4 ; 59.7,12.7 59.46,12.94 CN2.8 ; v1(55.56,34.6) R130.2
  Inner1 w0.254: v1(60.47,11.73) 63.36,8.84 v2(63.36,7.11) ; v1(55.56,34.6) 55.56,32.71
  Inner1 w1.016: v1(44.71,31.29) 45.93,32.51 59.4,32.51
  Inner1 w1.27: v1(69.46,34.66) 67.2,32.41 59.7,32.41 v1(59.7,12.19)
  Inner2 w0.254: v1(72,36.58) 71.31,37.26 v1(71.31,54.46)
  vias: v1(43.85,43.64) v1(43.85,42.68) v1(43.9,31.75) v1(43.9,30.79) v1(44.67,43.18) v1(58.99,11.73) v1(69.46,36.22) v1(69.46,35.46) v1(70.22,36.22) v1(70.22,35.46) v1(70.22,34.66) v1(70.99,35.46)
VCC_+12V: length 16.1
  Top Layer w0.254: 76.72,69.44 81.88,69.44 82.81,68.51 D2.1 84.75,68.47 85.05,68.17 SW1.3 SW1.6
  vias: v1(52.04,68.48) v1(52.04,66.44) v1(52.04,62.38) v1(52.04,60.35) v1(52.04,58.32) v1(52.04,56.28) v1(52.04,54.25) v1(54.07,68.48) v1(54.07,66.44) v1(54.07,62.38) v1(54.07,60.35) v1(54.07,58.32) v1(54.07,56.28) v1(54.07,54.25) v1(56.1,68.48) v1(56.1,66.44) v1(56.1,62.38) v1(56.1,60.35) v1(56.1,58.32) v1(56.1,56.28) v1(56.1,54.25) v1(58.13,68.48) v1(58.13,62.38) v1(58.13,60.35) v1(58.13,58.32) v1(58.13,56.28) v1(58.13,54.25) v1(60.16,68.48) v1(60.16,62.38) v1(60.16,60.35) v1(60.16,58.32) v1(62.2,68.48) v1(62.2,62.38) v1(62.2,58.32) v1(62.2,56.28) v1(64.23,68.48) v1(64.23,62.38) v1(64.23,58.32) v1(64.23,56.28) v1(64.23,54.25) v1(66.26,68.48) v1(66.26,62.38) v1(66.26,60.35) v1(66.26,58.32) v1(66.26,56.28) v1(66.26,54.25) v1(68.29,68.48) v1(68.29,66.44) v1(68.29,64.41) v1(68.29,62.38) v1(68.29,60.35) v1(68.29,58.32) v1(68.29,56.28) v1(68.29,54.25) v1(70.32,68.48) v1(70.32,66.44) v1(70.32,62.38) v1(70.32,60.35) v1(70.32,58.32) v1(70.32,56.28) v1(72.36,68.48) v1(72.36,66.44) v1(72.36,62.38) v1(72.36,60.35) v1(72.36,58.32) v1(72.36,56.28) v1(74.39,68.48) v1(74.39,64.41) v1(74.39,62.38) v1(74.39,58.32) v1(74.39,56.28) v1(76.42,62.38)
VCC_+24V:
  vias: v1(17.13,64.77) v1(17.13,60.7) v1(17.13,56.64) v1(19.16,62.74) v1(19.16,58.67) v1(19.16,54.61) v1(21.2,64.77) v1(21.2,60.7) v1(21.2,56.64) v1(23.23,58.67) v1(23.23,54.61) v1(25.26,56.64) v1(29.32,56.64) v1(31.36,66.8) v1(31.36,62.74) v1(31.36,54.61) v1(35.42,66.8) v1(35.42,62.74) v1(35.42,54.61) v1(39.48,66.8) v1(41.52,64.77) v1(43.55,54.61) v1(45.58,60.7) v1(45.58,56.64) v1(47.61,68.83) v1(47.61,58.67) v1(47.61,54.61) v1(49.64,66.8) v1(49.64,62.74) v1(49.64,60.7) v1(49.64,56.64)
VCC_BAT:
  vias: v1(78.55,56.03) v1(79.35,56.03) v1(80.13,56.03) v1(80.94,56.03) v1(81.79,56.03) v1(82.76,60.09) v1(82.76,59.06) v1(82.76,58.08) v1(82.76,57.11) v1(82.76,56.03) v1(83.75,60.09) v1(83.75,59.14) v1(84.65,60.09) v1(84.65,59.14)
232R: length 11.9
  Top Layer w0.254: H2.2 27.29,18.64 29.43,16.51 U54.3
232T: length 15.7
  Top Layer w0.254: U54.2 32.2,16.94 28.49,20.64 H2.1
ADC1_IN0: length 54.4
  Top Layer w0.178: v1(55.13,18.44) 56.63,18.44
  Inner2 w0.178: CN5.12 11.29,33.16 11.29,32.51 12.54,31.26 15.41,31.26 28,18.67 54.9,18.67 v1(55.13,18.44)
CAN1_RX: length 35.8
  Top Layer w0.178: CN2.51 46.48,23.69 40.09,30.07 40.09,39.72 41.41,41.05 44.31,41.05 45.28,42.01 45.28,46.99 44.05,48.21 H5.5
CAN1_TX: length 30
  Top Layer w0.178: H5.4 41.06,45.67 39.64,44.25 39.64,29.72 46.17,23.19 CN2.49
CAN2_RX: length 23.1
  Top Layer w0.178: H4.5 43.81,36.27 46.89,33.2 46.98,33.2 47.05,33.12 57.82,33.12 58.94,32 58.94,29.67 58.71,29.44 CN2.74
CAN2_TX: length 30.2
  Top Layer w0.178: H4.4 41.16,34.95 41.16,37.13 41.67,37.64 42.84,37.64 47,33.48 58.03,33.48 59.35,32.16 59.35,29.51 58.77,28.94 CN2.72
DATA_CANH: length 58.1
  Top Layer w0.254: H4.1 22.16,33.73 21.51,34.38 v1(21.51,35.05) ; v1(10.07,59.73) 11.79,59.73 12.31,60.25 H1.2
  Inner1 w0.254: v1(10.07,59.73) 10.07,59.17 9.84,58.95 9.84,58.05 11.53,56.37 11.53,53.12 13.34,51.31 16.08,51.31 18.76,48.63 18.76,46.24 21.3,43.7 21.3,35.82 21.51,35.61 v1(21.51,35.05) 21.51,34.41 21.3,34.21 21.3,33.13 18.96,30.78 12.72,30.78 10.72,28.78 5.73,28.78 5.51,29 CN5.21
DATA_CANL: length 65.1
  Top Layer w0.254: v1(9.21,59.73) 9.77,60.29 H1.4 ; v1(20.69,35.05) 20.69,35.56 21.4,36.27 H4.2
  Inner1 w0.254: CN5.22 3.57,26.89 3.57,30.02 4.43,30.89 6.41,30.89 8.11,29.19 10.51,29.19 12.51,31.19 18.79,31.19 20.9,33.3 20.9,34.2 20.69,34.41 v1(20.69,35.05) 20.69,35.61 20.89,35.82 20.89,43.53 18.35,46.07 18.35,48.46 15.91,50.9 13.17,50.9 11.12,52.95 11.12,56.2 9.44,57.89 9.44,58.95 9.21,59.17 v1(9.21,59.73)
DEBUG_CLK: length 17.1
  Top Layer w0.178: CN2.36 55.36,19.94 54.58,19.16 54.58,12.22 55.74,11.07 55.74,9.24 53.59,7.1 LINK1.2
DEBUG_DIO: length 25.5
  Top Layer w0.178: CN2.47 49.14,22.64 51.09,22.64 51.93,21.79 51.93,7.32 51.57,6.97 51.57,4.52 51.88,4.22 54.5,4.22 54.84,4.56 54.84,5.84
DEBUG_USART_RX: length 33.2
  Top Layer w0.178: v1(64.63,7.26) 64.63,5.86 USART1.2 ; CN2.53 51.57,24.19 52.39,23.37 52.39,7.67 v2(52.43,7.63)
  Inner2 w0.178: v1(64.63,7.26) 64.27,7.63 v2(52.43,7.63)
DEBUG_USART_TX: length 34.5
  Top Layer w0.178: v2(52.88,8.37) 52.88,23.84 52.03,24.69 CN2.55 ; v1(65.9,7.26) 65.9,5.88 USART1.3
  Inner2 w0.178: v2(52.88,8.37) 64.8,8.37 v1(65.9,7.26)
DIR_IO1: length 44.9
  Top Layer w0.178: v2(47.71,26.69) CN2.63
  Inner2 w0.178: CN5.1 16.7,49 39.01,26.69 v2(47.71,26.69)
DIR_IO2: length 43.4
  Top Layer w0.178: v2(47.05,26.19) CN2.61
  Inner2 w0.178: CN5.2 18.72,45 37.53,26.19 v2(47.05,26.19)
DOWNSHIFTSIGN_OUT: length 105.5
  Top Layer w0.254: v1(70.27,12.09) 70.27,15.95 69.71,16.51 68.14,16.51 67.86,16.78 67.86,17.5
  Inner2 w0.178: v1(70.27,12.09) 69.41,11.23 61.33,11.23 60.72,10.62 56.79,10.62 56.18,11.23 49.23,11.23 47.16,13.31 15.91,13.31 10.83,18.39 4.64,18.39 2.55,20.47 2.55,42.1 CN5.17
DOWNSIGN_IN: length 123.2
  Top Layer w0.178: SW9.1 96,51.95 93.97,49.92 93.97,33.7 89.68,29.41 84.72,29.41 84.4,29.09 C158.1
  Inner2 w0.178: v1(83.38,27.69) 83.38,29.41 80.38,32.41 48.07,32.41 45.33,29.67 41.16,29.67 19.67,51.15 7.3,51.15 5.45,49.31 CN5.16
IOOUT1: length 65.1
  Top Layer w0.254: v1(73.47,16.46) 73.45,16.47 U55.3
  Inner2 w0.178: CN5.7 13.71,25 22.91,15.8 72.81,15.8 v1(73.47,16.46)
IOOUT2: length 66.1
  Top Layer w0.254: v1(75.4,16.44) 75.4,17.49
  Inner2 w0.178: CN5.8 19.42,15.04 74,15.04 v1(75.4,16.44)
MCU_DOWMSHIFTSIGN_OUT: length 23.8
  Top Layer w0.178: CN2.21 50.42,16.19 50.86,15.75 v2(50.86,12.7) ; v1(67.32,12.9) 67.32,13.8 R237.2
  Inner2 w0.178: v1(67.32,12.9) 67.32,12.62 66.79,12.09 61.48,12.09 60.72,12.85 56.86,12.85 56.1,12.09 51.47,12.09 v2(50.86,12.7)
MCU_DOWNSIGN_IN: length 30.1
  Top Layer w0.178: R238.1 80.18,28.5 77.33,31.34 62.7,31.34 59.3,27.94 59.3,25.2 58.54,24.44 CN2.54
MCU_IOOUT1: length 45
  Top Layer w0.178: v1(73.32,12.44) R228.2 ; v2(55.25,9.97) 55.25,10.81 54.12,11.94 54.12,19.35 54.62,19.86 54.62,27.33 52.26,29.69 CN2.75
  Inner2 w0.178: v1(73.32,12.44) 70.84,9.97 v2(55.25,9.97)
MCU_IOOUT2: length 47.8
  Top Layer w0.178: CN2.71 52.55,28.69 54.27,26.97 54.27,20.47 53.45,19.66 v2(53.45,9.49) ; v1(74.84,12.29) R229.2
  Inner2 w0.178: v1(74.84,12.29) 72,9.45 53.5,9.45 v2(53.45,9.49)
MCU_IOOUT3: length 37
  Top Layer w0.178: CN2.69 49.09,28.18 52.14,28.18 53.87,26.45 53.87,21.22 v2(53.38,20.72) ; v1(74.84,28.04) R227.2
  Inner2 w0.178: v2(53.38,20.72) 57.41,20.72 63.97,27.28 74.08,27.28 v1(74.84,28.04)
MCU_IOOUT4: length 33.3
  Top Layer w0.178: v2(53.38,21.59) 53.38,26.29 51.98,27.69 CN2.67 ; v1(73.32,28.09) R226.2
  Inner2 w0.178: v1(73.32,28.09) 59.88,28.09 v2(53.38,21.59)
MCU_SERVOPWM_1: length 14.3
  Top Layer w0.178: R234.2 65.77,27.71 65.49,27.99 63.87,27.99 63,27.13 63,23.93 61.02,21.94 CN2.44
MCU_SERVOPWM_2: length 16.1
  Top Layer w0.178: CN2.46 60.76,22.44 62.34,24.03 62.34,27.18 63.61,28.45 66.71,28.45 67.3,27.86 R235.2
MCU_UPSHIFTSIGN_IN: length 28.9
  Top Layer w0.178: CN2.56 58.12,24.94 58.64,25.45 58.64,28.14 62.55,32.05 R194.1
MCU_UPSHIFTSIGN_OUT: length 21
  Top Layer w0.178: v1(65.8,12.95) 65.8,13.8 R236.2 ; v2(51.37,13.72) 51.37,15.85 50.53,16.69 CN2.23
  Inner2 w0.178: v1(65.8,12.95) 61.78,12.95 61.07,13.66 56.06,13.66 55.35,12.95 52.13,12.95 v2(51.37,13.72)
MOTO_CANH: length 81.1
  Top Layer w0.254: v1(12.31,65.89) H1.1 ; H5.1 22.31,45.67 21.61,46.37 v1(21.61,47.09)
  Inner1 w0.254: v1(21.61,47.09) 21.61,47.65 21.4,47.86 21.4,48.38 17,52.78 14.51,52.78 13.02,54.27 13.02,57.15 11.24,58.93 11.24,64.83 v1(12.31,65.89) 11.69,65.89 11.24,66.34 11.24,68.21 12.07,69.04 25.19,69.04 25.73,68.49 25.73,65.34 26.21,64.87 26.89,64.87 27.76,64 CN17.2 28.72,64.8 29.37,64.8 29.93,65.36 29.93,68.56 30.41,69.04 44.96,69.04 45.47,68.52 45.47,65.29 45.94,64.82 46.61,64.82 CN16.2
MOTO_CANL: length 82
  Top Layer w0.254: v1(9.77,65.89) H1.3 ; v1(20.79,47.09) 21.91,48.21 H5.2
  Inner1 w0.254: v1(20.79,47.09) 20.79,47.65 20.99,47.85 20.99,48.21 16.83,52.37 14.34,52.37 12.61,54.1 12.61,56.98 10.83,58.76 10.83,64.82 9.77,65.89 v1(9.77,65.89) 10.38,65.89 10.83,66.34 10.83,68.38 11.9,69.44 25.36,69.44 26.14,68.66 26.14,65.51 26.38,65.28 27.03,65.28 27.76,66 CN17.1 28.72,65.2 29.2,65.2 29.53,65.53 29.53,68.73 30.24,69.44 45.12,69.44 45.88,68.69 45.88,65.45 46.1,65.23 46.65,65.23 CN16.1
PA4: length 32.5
  Top Layer w0.178: CN2.40 60.05,20.94 60.77,20.22 60.77,13.61 63.66,10.72 R220.1
PA5: length 33.5
  Top Layer w0.178: CN2.42 60.97,21.44 61.58,20.83 61.58,14.27 64.38,11.48 76.26,11.48 79.06,14.27 R218.1
PB0: length 32.6
  Top Layer w0.178: CN2.52 58.9,23.94 60.06,25.09 60.06,27.74 63,30.68 76.97,30.68 79.72,27.94 79.72,25.45 80.23,24.94 R199.1
PC4: length 37.9
  Top Layer w0.178: CN2.48 60.29,22.94 61.58,24.23 61.58,27.22 63.72,29.36 76.31,29.36 78.45,27.23 78.45,19.91 80.53,17.83 R216.1
PC5: length 34.4
  Top Layer w0.178: CN2.50 56.74,23.55 59.48,23.55 60.77,24.84 60.77,27.23 63.36,29.82 76.72,29.82 79.11,27.43 79.11,24.22 80.39,22.94 80.39,22.05 R211.1
PD5: length 21.5
  Top Layer w0.178: CN2.31 45.13,18.69 44.2,19.62 33.15,19.62 32.63,19.1 32.63,17.22 33.1,16.74 34.84,16.74 H2.5
PD6: length 14.3
  Top Layer w0.178: H2.6 44.11,18.64 44.56,18.19 CN2.29
PD8: length 51
  Top Layer w0.178: v2(54.62,28.25) 55.43,27.44 CN2.66
  Inner2 w0.178: CN5.3 13.51,41.05 20.02,41.05 35.42,25.65 52.02,25.65 v2(54.62,28.25)
PD9: length 50.4
  Top Layer w0.178: v2(55.28,26.94) CN2.64
  Inner2 w0.178: CN5.4 16.81,37 30.54,23.27 51.61,23.27 v2(55.28,26.94)
SERVOPWM_1: length 64.1
  Top Layer w0.254: v1(66.56,24.38) U56.11
  Inner2 w0.178: CN5.6 14.6,29 26.38,17.22 62.95,17.22 66.56,20.83 v1(66.56,24.38)
SERVOPWM_2: length 69
  Top Layer w0.254: v1(70.22,26.42) 70.22,25.68 68.51,23.97 U56.8
  Inner2 w0.178: v1(70.22,26.42) 65.8,26.42 58.84,19.45 28.7,19.45 15.16,33 CN5.5
SWITCH1_IN: length 113.5
  Top Layer w0.178: SW12.1 96,41.95 94.25,40.2 94.25,31.7 88.41,25.86 84.85,25.86 84.4,25.41 C161.1
  Inner2 w0.178: CN5.20 9.92,33 12.18,30.74 14.38,30.74 27.23,17.89 61.09,17.89 63.92,20.72 63.92,23.47 65.85,25.4 82.21,25.4 v1(83.53,24.08)
SWITCH2_IN: length 111.6
  Top Layer w0.178: SW13.1 96,31.42 86.83,22.25 84.65,22.25 84.4,22.01 C162.1
  Inner2 w0.178: CN5.19 9.92,37 12.18,34.74 15.11,34.74 29.38,20.47 51.32,20.47 59.49,28.64 79.74,28.64 84.34,24.04 84.34,21.28 v1(83.53,20.47)
SWITCH3_IN: length 110.9
  Top Layer w0.178: SW14.1 91.93,17.93 88.25,17.93 87.24,18.95 84.95,18.95 84.4,18.4 C163.1
  Inner2 w0.178: CN5.11 9.45,38.31 12.51,35.25 17.03,35.25 30.59,21.69 51.32,21.69 58.64,29.01 80.28,29.01 85.05,24.23 85.05,18.29 v1(83.48,16.71)
SWITCH4_IN: length 114.2
  Top Layer w0.178: SW15.1 92.86,15.14 84.65,15.14 84.4,14.89 C164.1
  Inner2 w0.178: v1(83.53,13.51) 85.76,15.75 85.76,24.53 79.91,30.38 59.04,30.38 56.15,27.48 55.13,27.48 52.83,25.18 32.14,25.18 18.16,39.17 12.61,39.17 9.45,42.32 CN5.10
SWITCH5_IN: length 137
  Top Layer w0.178: SW16.1 93.67,2 92.62,3.04 92.62,6.65 91.5,7.77 84.49,7.77 83.99,8.28 83.99,8.94
  Inner2 w0.178: v1(82.26,9.85) 81.29,8.89 47.05,8.89 43.5,12.44 14.41,12.44 9.54,17.32 4.23,17.32 1.69,19.86 1.69,45.62 3.07,47 CN5.9
UPSHIFTSIGN_IN: length 139.7
  Top Layer w0.178: C160.1 84.4,32.62 84.95,33.17 91.2,33.17 93.69,35.66 93.69,59.64 96,61.95 SW11.1
  Inner2 w0.178: CN5.15 9.45,21.9 17.13,14.22 72.5,14.22 73.82,12.9 84.59,12.9 86.53,14.83 86.53,29.46 84.7,31.29 v1(83.27,31.29)
UPSHIFTSIGN_OUT: length 61.8
  Top Layer w0.254: v1(65.92,16.59) 65.91,16.6 U56.3
  Inner2 w0.178: v1(65.92,16.59) 65.83,16.49 25.23,16.49 14.72,27 CN5.14
$2N634: length 1.6
  Top Layer w0.254: C83.1 71.32,47.36 R131.2
$2N635: length 2.4
  Top Layer w0.254: 71.32,50.44 71.43,50.33 U27.6
$2N636: length 3.4
  Top Layer w0.254: U27.1 79.06,47.78 79.06,46.58 78.49,46.02 C81.1
$2N639: length 3.7
  Top Layer w0.254: U27.5 73.71,52.87 R128.1 R129.2
$2N641: length 1.5
  Top Layer w0.254: R130.1 51.52,34.6 LED6.2
$2N642: length 2.2
  Top Layer w0.254: R127.1 71.36,51.99 72.84,53.48 R128.2
$2N644: length 3.2
  Top Layer w0.254: U27.4 80.22,51.6 80.48,51.87 80.48,53.46 R126.2
$2N909: length 24.1
  Top Layer w0.254: v1(77.11,56.89) 77.09,56.87 Q11.4 ; SW1.2 v1(86.53,64.94) SW1.5
  Bottom Layer w0.254: v1(77.11,56.89) 77.79,56.89 78.04,57.14 78.04,61.62 78.8,62.38 85.87,62.38 86.53,63.05 v1(86.53,64.94)
$2N910: length 11.4
  Top Layer w0.254: D2.2 82.83,65.15 R132.2 84.85,63.39 85.05,63.19 SW1.1 SW1.4
$2N1574:
  vias: v1(62.58,46.48) v1(63.3,46.78) v1(64.03,46.62) v1(65.94,37.39) v1(65.94,36.68) v1(65.94,35.94)
$2N1704: length 1.5
  Top Layer w0.254: LED7.2 53.01,36.51 R135.1
$2N1742: length 2.2
  Top Layer w0.254: U32.6 62.23,48.03 61.57,47.37 C87.2
$2N1819: length 3.8
  Top Layer w0.254: U32.5 64.43,47.34 64.73,47.04 66.19,47.04 66.53,47.39 R136.2
$2N1977: length 4.2
  Top Layer w0.254: R137.2 66.62,50.72 66.61,50.71 66.61,48.67 65.98,48.03 U32.4
$3N17976: length 3.9
  Top Layer w0.254: U55.2 72.8,16.21 73.32,15.7 R228.1 R223.2
$3N17982: length 3.7
  Top Layer w0.254: R222.2 R229.1 74.75,15.42 U55.5
$3N18603: length 3.9
  Top Layer w0.178: R231.2 R236.1
  Top Layer w0.254: U56.2 65.26,16.42 65.77,15.91 R236.1
$3N18609: length 3.7
  Top Layer w0.178: R237.1 R230.2
  Top Layer w0.254: U56.5 67.21,15.42 R237.1
$3N20257: length 3.9
  Top Layer w0.254: R232.2 R235.1 67.3,25.07 67.86,24.5 67.86,23.35
$3N20268: length 3.7
  Top Layer w0.254: R233.2 R234.1 65.91,25.37 U56.12
$3N20297: length 3.9
  Top Layer w0.178: R227.1 R224.2
  Top Layer w0.254: U55.9 75.4,24.02 74.84,24.59 R227.1
$3N20302: length 3.8
  Top Layer w0.254: U55.12 73.47,23.36 73.47,25.36 R226.1 R225.2

## Copper pours and planes (outline as drawn; the poured copper is in the pictures)
GND_BAT on Top Layer: 56.91,52.71 56.91,50.73 57.37,50.27 59.3,50.27 59.8,50.78 59.8,52.69 59.77,52.73 56.93,52.73
GND_BAT on Top Layer: 56.88,50.88 57.47,50.29 59.35,50.29 59.5,50.14 59.5,45.31 56.3,42.11 47.85,42.11 46.83,41.1 46.83,34.36 47.51,33.68 91.71,33.68 93.69,35.66 93.69,70.36 92.93,71.12 79.01,71.12 77.69,69.8 77.69,55.73 77.28,55.32 70.73,55.32 69.86,54.46 69.86,53.29 68.8,52.22 57.21,52.22 57.16,52.27 56.88,51.99
GND_BAT on Top Layer: 56.66,65.02 56.67,65.22 56.73,65.44 56.82,65.65 56.95,65.84 57.11,66 57.3,66.13 57.51,66.22 57.73,66.28 57.93,66.29 66.05,66.29 66.25,66.28 66.47,66.22 66.68,66.13 66.87,66 67.03,65.84 67.16,65.65 67.25,65.44 67.31,65.22 67.32,65.02 67.32,64.97 67.31,64.77 67.25,64.55 67.16,64.35 67.03,64.16 66.87,64 66.68,63.87 66.47,63.77 66.25,63.72 66.05,63.7 57.93,63.7 57.73,63.72 57.51,63.77 57.3,63.87 57.11,64 56.95,64.16 56.82,64.35 56.73,64.55 56.67,64.77 56.66,64.97
GND_BAT on Bottom Layer: 56.88,50.88 57.47,50.29 59.35,50.29 59.5,50.14 59.5,45.31 56.3,42.11 47.85,42.11 46.83,41.1 46.83,34.36 47.51,33.68 91.71,33.68 93.69,35.66 93.69,70.36 92.93,71.12 79.01,71.12 77.69,69.8 77.69,55.73 77.28,55.32 70.73,55.32 69.86,54.46 69.86,53.29 68.8,52.22 57.21,52.22 57.16,52.27 56.88,51.99
GND_BAT on Bottom Layer: 15,72.03 15,54.3 16.83,52.47 48.65,52.47 50.42,54.25 50.42,72.07 50.31,72.19 15.15,72.19
GND_BAT on Bottom Layer: 56.66,65.02 56.67,65.22 56.73,65.44 56.82,65.65 56.95,65.84 57.11,66 57.3,66.13 57.51,66.22 57.73,66.28 57.93,66.29 66.05,66.29 66.25,66.28 66.47,66.22 66.68,66.13 66.87,66 67.03,65.84 67.16,65.65 67.25,65.44 67.31,65.22 67.32,65.02 67.32,64.97 67.31,64.77 67.25,64.55 67.16,64.35 67.03,64.16 66.87,64 66.68,63.87 66.47,63.77 66.25,63.72 66.05,63.7 57.93,63.7 57.73,63.72 57.51,63.77 57.3,63.87 57.11,64 56.95,64.16 56.82,64.35 56.73,64.55 56.67,64.77 56.66,64.97
GND_BAT on Inner1: 56.88,50.88 57.47,50.29 59.35,50.29 59.5,50.14 59.5,45.31 56.3,42.11 47.85,42.11 46.83,41.1 46.83,34.36 47.51,33.68 91.71,33.68 93.69,35.66 93.69,70.36 92.93,71.12 79.01,71.12 77.69,69.8 77.69,55.73 77.28,55.32 70.73,55.32 69.86,54.46 69.86,53.29 68.8,52.22 57.21,52.22 57.16,52.27 56.88,51.99
GND_BAT on Inner1: 56.66,65.02 56.67,65.22 56.73,65.44 56.82,65.65 56.95,65.84 57.11,66 57.3,66.13 57.51,66.22 57.73,66.28 57.93,66.29 66.05,66.29 66.25,66.28 66.47,66.22 66.68,66.13 66.87,66 67.03,65.84 67.16,65.65 67.25,65.44 67.31,65.22 67.32,65.02 67.32,64.97 67.31,64.77 67.25,64.55 67.16,64.35 67.03,64.16 66.87,64 66.68,63.87 66.47,63.77 66.25,63.72 66.05,63.7 57.93,63.7 57.73,63.72 57.51,63.77 57.3,63.87 57.11,64 56.95,64.16 56.82,64.35 56.73,64.55 56.67,64.77 56.66,64.97
GND_BAT on Inner2: 56.88,50.88 57.47,50.29 59.35,50.29 59.5,50.14 59.5,45.31 56.3,42.11 47.85,42.11 46.83,41.1 46.83,34.36 47.51,33.68 91.71,33.68 93.69,35.66 93.69,70.36 92.93,71.12 79.01,71.12 77.69,69.8 77.69,55.73 77.28,55.32 70.73,55.32 69.86,54.46 69.86,53.29 68.8,52.22 57.21,52.22 57.16,52.27 56.88,51.99
GND_BAT on Inner2: 15,72.03 15,54.3 16.83,52.47 48.65,52.47 50.42,54.25 50.42,72.07 50.31,72.19 15.15,72.19
GND_BAT on Inner2: 56.91,52.78 56.91,50.8 57.37,50.34 59.3,50.34 59.8,50.85 59.8,52.76 59.77,52.8 56.93,52.8
GND_BAT on Inner2: 56.66,65.02 56.67,65.22 56.73,65.44 56.82,65.65 56.95,65.84 57.11,66 57.3,66.13 57.51,66.22 57.73,66.28 57.93,66.29 66.05,66.29 66.25,66.28 66.47,66.22 66.68,66.13 66.87,66 67.03,65.84 67.16,65.65 67.25,65.44 67.31,65.22 67.32,65.02 67.32,64.97 67.31,64.77 67.25,64.55 67.16,64.35 67.03,64.16 66.87,64 66.68,63.87 66.47,63.77 66.25,63.72 66.05,63.7 57.93,63.7 57.73,63.72 57.51,63.77 57.3,63.87 57.11,64 56.95,64.16 56.82,64.35 56.73,64.55 56.67,64.77 56.66,64.97
GND_BAT on Inner2: 49.9,71.98 49.9,53.29 51.07,52.12 68.85,52.12 69.96,53.24 69.96,54.46 70.83,55.32 77.23,55.32 78.3,56.39 78.3,71.73 76.82,73.2 51.52,73.2 51.47,73.15 51.07,73.15
GND_PRO on Top Layer: -4.92,73.76 -4.92,1.17 1.33,-5.08 103.19,-5.08 105.88,-2.39 105.88,68.73 101.16,73.46 -2.32,73.46 -2.43,73.35 -4.51,73.35
GND_PRO on Bottom Layer: -4.92,73.76 -4.92,1.17 1.33,-5.08 103.19,-5.08 105.88,-2.39 105.88,68.73 101.16,73.46 -2.32,73.46 -2.43,73.35 -4.51,73.35
GND_PRO on Inner1: -4.92,73.76 -4.92,1.17 1.33,-5.08 103.19,-5.08 105.88,-2.39 105.88,68.73 101.16,73.46 -2.32,73.46 -2.43,73.35 -4.51,73.35
GND_PRO on Inner2: -4.92,73.76 -4.92,1.17 1.33,-5.08 103.19,-5.08 105.88,-2.39 105.88,68.73 101.16,73.46 -2.32,73.46 -2.43,73.35 -4.51,73.35
VCC_+3V3 on Top Layer: 64.88,38.25 65.29,37.84 65.29,33.98 64.88,33.58 59.09,33.58 58.33,34.34 58.33,37.59 58.99,38.25
VCC_+3V3 on Top Layer: 49.29,41.19 49.26,41.38 49.2,41.56 49.11,41.73 49,41.89 48.86,42.02 48.71,42.14 48.54,42.22 48.35,42.28 48.17,42.31 47.97,42.31 47.78,42.28 47.6,42.22 47.43,42.14 47.28,42.02 47.14,41.89 47.03,41.73 46.94,41.56 46.88,41.38 46.85,41.19 46.85,41 46.88,40.81 46.94,40.63 47.03,40.46 47.14,40.3 47.28,40.17 47.43,40.05 47.6,39.97 47.78,39.91 47.97,39.88 48.17,39.88 48.35,39.91 48.54,39.97 48.71,40.05 48.86,40.17 49,40.3 49.11,40.46 49.2,40.63 49.26,40.81 49.29,41
VCC_+3V3 on Inner1: 59.65,34.44 59.65,33.93 59.8,33.78 63.16,33.78 63.92,34.54 63.92,35.21 60.42,35.21
VCC_+5V on Top Layer: 58.64,13.16 58.64,11.32 58.99,10.96 60.57,10.96 60.91,11.3 60.91,13.13 60.72,13.31 58.79,13.31
VCC_+5V on Top Layer: 74.3,34.15 73.83,33.68 68.03,33.68 67.63,34.09 67.63,37.92 67.35,38.19 66.16,38.19 65.88,38.47 65.88,43.86 65.09,44.65 65.09,46.68 68.03,46.68 68.44,46.28 68.44,44.04 69.56,42.92 69.56,38.05 70.42,37.18 73.82,37.18 74.3,36.71
VCC_+5V on Top Layer: 41.62,44.45 40.91,43.74 40.91,42.62 41.67,41.86 44.31,41.86 45.07,42.62 45.07,43.74 44.36,44.45
VCC_+5V on Top Layer: 41.66,32.56 40.95,31.85 40.95,30.73 41.76,29.92 44.3,29.92 45.12,30.73 45.12,31.85 44.4,32.56
VCC_+5V on Inner1: 71.8,35.58 71.76,35.83 71.68,36.06 71.57,36.29 71.43,36.49 71.25,36.66 71.05,36.81 70.83,36.92 70.59,37 70.34,37.04 70.09,37.04 69.85,37 69.61,36.92 69.39,36.81 69.19,36.66 69.01,36.49 68.87,36.29 68.75,36.06 68.68,35.83 68.64,35.58 68.64,35.33 68.68,35.09 68.75,34.85 68.87,34.63 69.01,34.43 69.19,34.25 69.39,34.1 69.61,33.99 69.85,33.91 70.09,33.87 70.34,33.87 70.59,33.91 70.83,33.99 71.05,34.1 71.25,34.25 71.43,34.43 71.57,34.63 71.68,34.85 71.76,35.09 71.8,35.33
VCC_+5V on Inner1: 60.96,11.84 60.93,12.04 60.87,12.23 60.78,12.4 60.66,12.56 60.52,12.7 60.36,12.82 60.19,12.91 60,12.97 59.8,13 59.6,13 59.41,12.97 59.22,12.91 59.04,12.82 58.88,12.7 58.74,12.56 58.63,12.4 58.54,12.23 58.48,12.04 58.45,11.84 58.45,11.64 58.48,11.45 58.54,11.26 58.63,11.09 58.74,10.93 58.88,10.79 59.04,10.67 59.22,10.58 59.41,10.52 59.6,10.49 59.8,10.49 60,10.52 60.19,10.58 60.36,10.67 60.52,10.79 60.66,10.93 60.78,11.09 60.87,11.26 60.93,11.45 60.96,11.64
VCC_+5V on Inner1: 45.2,43.27 45.17,43.45 45.12,43.62 45.04,43.78 44.93,43.93 44.8,44.05 44.66,44.16 44.5,44.24 44.32,44.3 44.15,44.32 43.97,44.32 43.79,44.3 43.62,44.24 43.46,44.16 43.31,44.05 43.18,43.93 43.08,43.78 42.99,43.62 42.94,43.45 42.91,43.27 42.91,43.09 42.94,42.91 42.99,42.74 43.08,42.58 43.18,42.43 43.31,42.3 43.46,42.2 43.62,42.12 43.79,42.06 43.97,42.03 44.15,42.03 44.32,42.06 44.5,42.12 44.66,42.2 44.8,42.3 44.93,42.43 45.04,42.58 45.12,42.74 45.17,42.91 45.2,43.09
VCC_+5V on Inner1: 45.36,31.39 45.33,31.57 45.27,31.75 45.19,31.92 45.08,32.08 44.94,32.21 44.79,32.32 44.62,32.41 44.44,32.47 44.25,32.5 44.06,32.5 43.88,32.47 43.7,32.41 43.53,32.32 43.37,32.21 43.24,32.08 43.13,31.92 43.04,31.75 42.98,31.57 42.95,31.39 42.95,31.2 42.98,31.01 43.04,30.83 43.13,30.66 43.24,30.51 43.37,30.37 43.53,30.26 43.7,30.18 43.88,30.12 44.06,30.09 44.25,30.09 44.44,30.12 44.62,30.18 44.79,30.26 44.94,30.37 45.08,30.51 45.19,30.66 45.27,30.83 45.33,31.01 45.36,31.2
VCC_+5V on Inner2: 43.19,43.18 43.21,43.38 43.26,43.6 43.36,43.81 43.49,43.99 43.65,44.15 43.84,44.28 44.04,44.38 44.26,44.43 44.46,44.45 44.01,44.45 44.2,44.43 44.43,44.38 44.63,44.28 44.82,44.15 44.98,43.99 45.11,43.81 45.2,43.6 45.26,43.38 45.28,43.18 45.28,31.55 45.26,31.35 45.2,31.13 45.11,30.92 44.98,30.73 44.82,30.57 44.63,30.44 44.43,30.35 44.2,30.29 44.01,30.28 44.46,30.28 44.26,30.29 44.04,30.35 43.84,30.44 43.65,30.57 43.49,30.73 43.36,30.92 43.26,31.13 43.21,31.35 43.19,31.55
VCC_+12V on Top Layer: 49.9,71.98 49.9,53.29 51.07,52.12 68.85,52.12 69.96,53.24 69.96,54.46 70.83,55.32 77.23,55.32 77.63,55.73 77.63,72.39 76.82,73.2 51.52,73.2 51.47,73.15 51.07,73.15
VCC_+12V on Bottom Layer: 49.9,71.98 49.9,53.29 51.07,52.12 68.85,52.12 69.96,53.24 69.96,54.46 70.83,55.32 77.23,55.32 77.63,55.73 77.63,72.39 76.82,73.2 51.52,73.2 51.47,73.15 51.07,73.15
VCC_+12V on Inner1: 49.9,71.98 49.9,53.29 51.07,52.12 68.85,52.12 69.96,53.24 69.96,54.46 70.83,55.32 77.23,55.32 77.63,55.73 77.63,72.39 76.82,73.2 51.52,73.2 51.47,73.15 51.07,73.15
VCC_+24V on Top Layer: 15,72.03 15,54.3 16.83,52.47 48.65,52.47 50.42,54.25 50.42,72.07 50.31,72.19 15.15,72.19
VCC_+24V on Inner1: 15,72.03 15,54.3 16.83,52.47 48.65,52.47 50.42,54.25 50.42,72.07 50.31,72.19 15.15,72.19
VCC_BAT on Top Layer: 77.48,61.16 77.48,55.78 77.89,55.37 83.2,55.37 84.22,56.39 85.51,56.39 85.97,56.84 85.97,58.83 85.41,59.38 85.41,60.3 84.54,61.16
VCC_BAT on Top Layer: 77.48,61.16 77.48,55.78 77.89,55.37 83.2,55.37 84.22,56.39 85.51,56.39 85.97,56.84 85.97,58.83 85.41,59.38 85.41,60.3 84.54,61.16
VCC_BAT on Bottom Layer: 77.42,61.16 77.42,55.78 77.82,55.37 83.14,55.37 84.15,56.39 85.45,56.39 85.9,56.84 85.9,58.83 85.34,59.38 85.34,60.3 84.48,61.16
VCC_BAT on Inner1: 77.48,61.16 77.48,55.78 77.89,55.37 83.2,55.37 84.22,56.39 85.51,56.39 85.97,56.84 85.97,58.83 85.41,59.38 85.41,60.3 84.54,61.16
VCC_BAT on Inner2: 77.42,61.16 77.42,55.78 77.82,55.37 83.14,55.37 84.15,56.39 85.45,56.39 85.9,56.84 85.9,58.83 85.34,59.38 85.34,60.3 84.48,61.16
DOWNSIGN_IN on Top Layer: 82.12,26.25 82.31,26.06 84.81,26.06 85.06,26.31 85.06,28.65 84.75,28.95 82.12,28.95
SWITCH1_IN on Top Layer: 82.17,22.69 82.35,22.5 84.85,22.5 85.1,22.76 85.1,25.09 84.79,25.4 82.17,25.4
SWITCH2_IN on Top Layer: 82.17,19.14 82.36,18.95 84.85,18.95 85.11,19.2 85.11,21.53 84.8,21.84 82.17,21.84
SWITCH3_IN on Top Layer: 82.17,15.58 82.36,15.39 84.85,15.39 85.11,15.65 85.11,17.98 84.8,18.29 82.17,18.29
SWITCH4_IN on Top Layer: 82.17,12.02 82.36,11.84 84.85,11.84 85.11,12.09 85.11,14.42 84.8,14.73 82.17,14.73
SWITCH5_IN on Top Layer: 82.17,8.47 82.35,8.28 84.85,8.28 85.1,8.53 85.1,10.87 84.79,11.18 82.17,11.18
UPSHIFTSIGN_IN on Top Layer: 82.17,29.8 82.36,29.61 84.85,29.61 85.11,29.87 85.11,32.2 84.8,32.51 82.17,32.51
$2N637 on Top Layer: 76.52,44.91 74.59,42.98 74.59,34.14 75.09,33.63 86.4,33.63 86.87,34.1 86.87,43.08 85.97,43.99 81.29,43.99 80.38,44.91
$2N640 on Top Layer: 72.81,48.31 72.39,47.89 72.39,45.44 69.91,42.96 69.91,37.95 70.47,37.39 73.98,37.39 74.44,37.84 74.44,43.03 76.4,44.99 76.4,46.95 76.26,47.09 75.39,47.09 74.87,47.61 74.87,48.13 74.69,48.31
$2N643 on Top Layer: 85.87,58.62 85.87,56.79 85.38,56.31 84.14,56.31 81.75,53.92 81.75,51.76 81.04,51.05 78.19,51.05 77.74,50.6 77.74,48.87 78.19,48.41 80.33,48.41 80.99,47.75 80.99,44.65 81.44,44.19 87.39,44.19 87.54,44.35 87.54,50.26 86.87,50.93 86.87,52.77 87.49,53.39 91.1,53.39 91.66,53.95 91.66,58.57 91.2,59.03 86.27,59.03
$2N1574 on Top Layer: 65.54,37.84 67.53,37.84 67.53,35.51 65.54,35.51
$2N1574 on Top Layer: 64.87,46.53 64.87,44.7 64.77,44.6 64.06,44.6 63.95,44.7 63.95,45.92 63.9,45.97 62.68,45.97 62.63,45.92 62.63,45.01 62.43,44.8 60.8,44.8 60.6,45.01 60.6,46.53 60.87,46.8 62.31,46.8 62.51,47.01 62.51,47.27 62.63,47.39 64.14,47.39 64.23,47.29 64.23,47.15 64.56,46.83 64.79,46.83 64.87,46.76
$2N1574 on Inner2: 62.19,46.84 62.19,46.34 62.42,46.11 64.33,46.11 65.7,44.74 65.7,38 65.48,37.79 65.48,35.7 65.73,35.46 66.17,35.46 66.35,35.63 66.35,37.83 66.13,38.04 66.13,45.65 64.75,47.03 62.38,47.03 62.29,46.94 62.29,46.94

Small or netless copper shapes (teardrops, artwork), in the pictures only: 226 on Top Layer, 2 on Bottom Layer, 41 on Inner1, 49 on Inner2

## Text on the board
Bottom Silkscreen Layer: JLCJLCJLC | GND | CNAL | CANH | SW1 | SW2 | 3V3 | DSOU | DSIN | UPIN | UPOU | ADC | SW3 | SW4 | SW5 | IOO2 | IOO1 | PWM1 | PWM2 | RX | TX | DIO2 | DIO1 | 16 | 23 | 9 | 15 | 1 | 8 | Designed By / SongJC Ver 2.0 | + | 。。。。。。。。 | 。。。。。。。 | 08
